# Altium schematic sheet 08_SAMA7G54-DDR3.SchDoc
size 420 x 297 mm; SheetNumber: 16; SheetTotal: 33
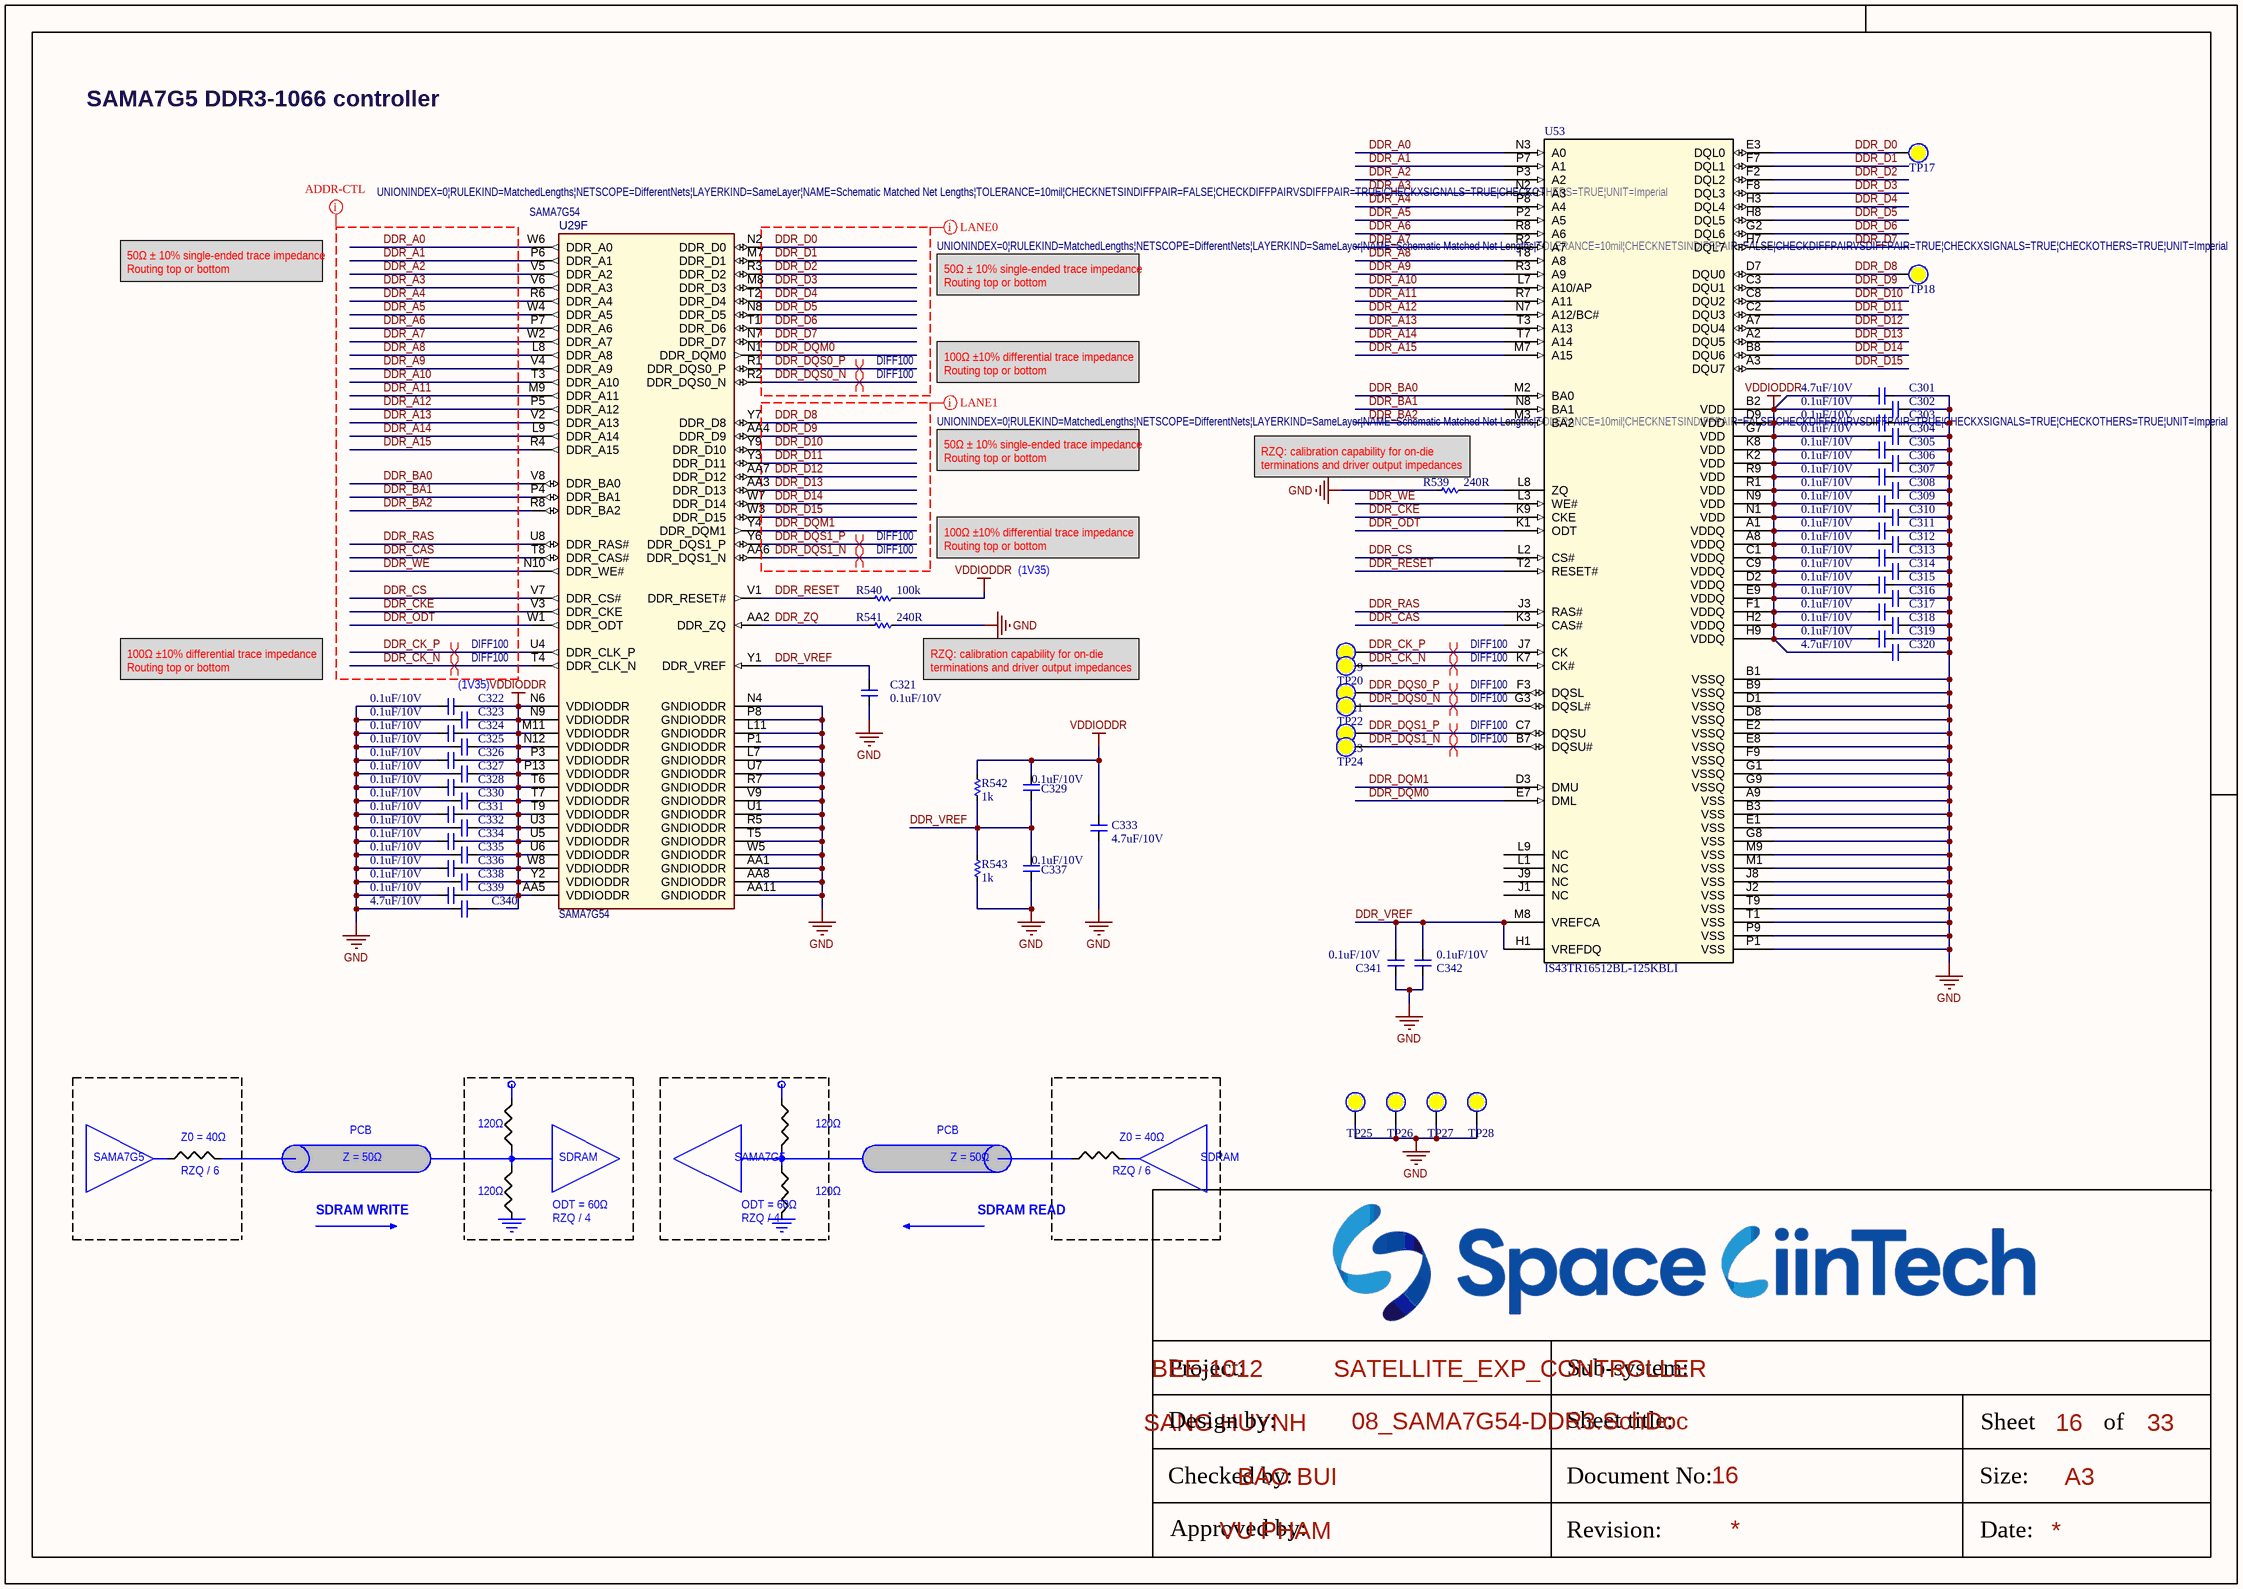
[diagram p0: 08_SAMA7G54-DDR3.SchDoc]

## Parts
C301  4.7uF/10V  [CAP_C_1005X50_L]
C302  0.1uF/10V  [CAP_C_0603x30]
C303  0.1uF/10V  [CAP_C_0603x30]
C304  0.1uF/10V  [CAP_C_0603x30]
C305  0.1uF/10V  [CAP_C_0603x30]
C306  0.1uF/10V  [CAP_C_0603x30]
C307  0.1uF/10V  [CAP_C_0603x30]
C308  0.1uF/10V  [CAP_C_0603x30]
C309  0.1uF/10V  [CAP_C_0603x30]
C310  0.1uF/10V  [CAP_C_0603x30]
C311  0.1uF/10V  [CAP_C_0603x30]
C312  0.1uF/10V  [CAP_C_0603x30]
C313  0.1uF/10V  [CAP_C_0603x30]
C314  0.1uF/10V  [CAP_C_0603x30]
C315  0.1uF/10V  [CAP_C_0603x30]
C316  0.1uF/10V  [CAP_C_0603x30]
C317  0.1uF/10V  [CAP_C_0603x30]
C318  0.1uF/10V  [CAP_C_0603x30]
C319  0.1uF/10V  [CAP_C_0603x30]
C320  4.7uF/10V  [CAP_C_1005X50_L]
C321  0.1uF/10V  [CAP_C_0603x30]
C322  0.1uF/10V  [CAP_C_0603x30]
C323  0.1uF/10V  [CAP_C_0603x30]
C324  0.1uF/10V  [CAP_C_0603x30]
C325  0.1uF/10V  [CAP_C_0603x30]
C326  0.1uF/10V  [CAP_C_0603x30]
C327  0.1uF/10V  [CAP_C_0603x30]
C328  0.1uF/10V  [CAP_C_0603x30]
C329  0.1uF/10V  [CAP_C_0603x30]
C330  0.1uF/10V  [CAP_C_0603x30]
C331  0.1uF/10V  [CAP_C_0603x30]
C332  0.1uF/10V  [CAP_C_0603x30]
C333  4.7uF/10V  [CAP_C_1005X50_L]
C334  0.1uF/10V  [CAP_C_0603x30]
C335  0.1uF/10V  [CAP_C_0603x30]
C336  0.1uF/10V  [CAP_C_0603x30]
C337  0.1uF/10V  [CAP_C_0603x30]
C338  0.1uF/10V  [CAP_C_0603x30]
C339  0.1uF/10V  [CAP_C_0603x30]
C340  4.7uF/10V  [CAP_C_1005X50_L]
C341  0.1uF/10V  [CAP_C_0603x30]
C342  0.1uF/10V  [CAP_C_0603x30]
R539  240R  [RES_C_0603X30]
R540  100k  [RES_C_0603X30]
R541  240R  [RES_C_0603X30]
R542  1k  [RES_C_0603X30]
R543  1k  [RES_C_0603X30]
TP17  (no value)  [TP_1mm_SMD]  (no BOM)
TP18  (no value)  [TP_1mm_SMD]  (no BOM)
TP19  (no value)  [TP_1mm_SMD]  (no BOM)
TP20  (no value)  [TP_1mm_SMD]  (no BOM)
TP21  (no value)  [TP_1mm_SMD]  (no BOM)
TP22  (no value)  [TP_1mm_SMD]  (no BOM)
TP23  (no value)  [TP_1mm_SMD]  (no BOM)
TP24  (no value)  [TP_1mm_SMD]  (no BOM)
TP25  (no value)  [TP_1mm_SMD]  (no BOM)
TP26  (no value)  [TP_1mm_SMD]  (no BOM)
TP27  (no value)  [TP_1mm_SMD]  (no BOM)
TP28  (no value)  [TP_1mm_SMD]  (no BOM)
U29  SAMA7G54  [TFBGA-343_14x14 - 2.5mm]  (part F of 8)
U53  IS43TR16512BL-125KBLI  [TWBGA96_ISI]

## Nets
GND: C301.1 C302.1 C303.1 C304.1 C305.1 C306.1 C307.1 C308.1 C309.1 C310.1 C311.1 C312.1 C313.1 C314.1 C315.1 C316.1 C317.1 C318.1 C319.1 C320.1 C321.2 C322.2 C323.2 C324.2 C325.2 C326.2 C327.2 C328.2 C330.2 C331.2 C332.2 C333.2 C334.2 C335.2 C336.2 C337.2 C338.2 C339.2 C340.2 C341.2 C342.2 R539.2 R541.1 R543.2 TP25.0 TP26.0 TP27.0 TP28.0 U29.AA1(GNDIODDR) U29.AA8(GNDIODDR) U29.AA11(GNDIODDR) U29.L7(GNDIODDR) U29.L11(GNDIODDR) U29.N4(GNDIODDR) U29.P1(GNDIODDR) U29.P8(GNDIODDR) U29.R5(GNDIODDR) U29.R7(GNDIODDR) U29.T5(GNDIODDR) U29.U1(GNDIODDR) U29.U7(GNDIODDR) U29.V9(GNDIODDR) U29.W5(GNDIODDR) U53.A9(VSS) U53.B1(VSSQ) U53.B3(VSS) U53.B9(VSSQ) U53.D1(VSSQ) U53.D8(VSSQ) U53.E1(VSS) U53.E2(VSSQ) U53.E8(VSSQ) U53.F9(VSSQ) U53.G1(VSSQ) U53.G8(VSS) U53.G9(VSSQ) U53.J2(VSS) U53.J8(VSS) U53.M1(VSS) U53.M9(VSS) U53.P1(VSS) U53.P9(VSS) U53.T1(VSS) U53.T9(VSS)
VDDIODDR: C301.2 C302.2 C303.2 C304.2 C305.2 C306.2 C307.2 C308.2 C309.2 C310.2 C311.2 C312.2 C313.2 C314.2 C315.2 C316.2 C317.2 C318.2 C319.2 C320.2 C322.1 C323.1 C324.1 C325.1 C326.1 C327.1 C328.1 C329.1 C330.1 C331.1 C332.1 C333.1 C334.1 C335.1 C336.1 C338.1 C339.1 C340.1 R540.1 R542.1 U29.AA5(VDDIODDR) U29.M11(VDDIODDR) U29.N6(VDDIODDR) U29.N9(VDDIODDR) U29.N12(VDDIODDR) U29.P3(VDDIODDR) U29.P13(VDDIODDR) U29.T6(VDDIODDR) U29.T7(VDDIODDR) U29.T9(VDDIODDR) U29.U3(VDDIODDR) U29.U5(VDDIODDR) U29.U6(VDDIODDR) U29.W8(VDDIODDR) U29.Y2(VDDIODDR) U53.A1(VDDQ) U53.A8(VDDQ) U53.B2(VDD) U53.C1(VDDQ) U53.C9(VDDQ) U53.D2(VDDQ) U53.D9(VDD) U53.E9(VDDQ) U53.F1(VDDQ) U53.G7(VDD) U53.H2(VDDQ) U53.H9(VDDQ) U53.K2(VDD) U53.K8(VDD) U53.N1(VDD) U53.N9(VDD) U53.R1(VDD) U53.R9(VDD)
DDR_A0: U29.W6(DDR_A0) U53.N3(A0)
DDR_A1: U29.P6(DDR_A1) U53.P7(A1)
DDR_A2: U29.V5(DDR_A2) U53.P3(A2)
DDR_A3: U29.V6(DDR_A3) U53.N2(A3)
DDR_A4: U29.R6(DDR_A4) U53.P8(A4)
DDR_A5: U29.W4(DDR_A5) U53.P2(A5)
DDR_A6: U29.P7(DDR_A6) U53.R8(A6)
DDR_A7: U29.W2(DDR_A7) U53.R2(A7)
DDR_A8: U29.L8(DDR_A8) U53.T8(A8)
DDR_A9: U29.V4(DDR_A9) U53.R3(A9)
DDR_A10: U29.T3(DDR_A10) U53.L7(A10/AP)
DDR_A11: U29.M9(DDR_A11) U53.R7(A11)
DDR_A12: U29.P5(DDR_A12) U53.N7(A12/BC#)
DDR_A13: U29.V2(DDR_A13) U53.T3(A13)
DDR_A14: U29.L9(DDR_A14) U53.T7(A14)
DDR_A15: U29.R4(DDR_A15) U53.M7(A15)
DDR_BA0: U29.V8(DDR_BA0) U53.M2(BA0)
DDR_BA1: U29.P4(DDR_BA1) U53.N8(BA1)
DDR_BA2: U29.R8(DDR_BA2) U53.M3(BA2)
DDR_CAS: U29.T8(DDR_CAS#) U53.K3(CAS#)
DDR_CK_N: TP20.0 U29.T4(DDR_CLK_N) U53.K7(CK#)
DDR_CK_P: TP19.0 U29.U4(DDR_CLK_P) U53.J7(CK)
DDR_CKE: U29.V3(DDR_CKE) U53.K9(CKE)
DDR_CS: U29.V7(DDR_CS#) U53.L2(CS#)
DDR_D0: TP17.0 U29.N2(DDR_D0) U53.E3(DQL0)
DDR_D1: U29.M7(DDR_D1) U53.F7(DQL1)
DDR_D2: U29.R3(DDR_D2) U53.F2(DQL2)
DDR_D3: U29.M8(DDR_D3) U53.F8(DQL3)
DDR_D4: U29.T2(DDR_D4) U53.H3(DQL4)
DDR_D5: U29.N8(DDR_D5) U53.H8(DQL5)
DDR_D6: U29.T1(DDR_D6) U53.G2(DQL6)
DDR_D7: U29.N7(DDR_D7) U53.H7(DQL7)
DDR_D8: TP18.0 U29.Y7(DDR_D8) U53.D7(DQU0)
DDR_D9: U29.AA4(DDR_D9) U53.C3(DQU1)
DDR_D10: U29.Y9(DDR_D10) U53.C8(DQU2)
DDR_D11: U29.Y3(DDR_D11) U53.C2(DQU3)
DDR_D12: U29.AA7(DDR_D12) U53.A7(DQU4)
DDR_D13: U29.AA3(DDR_D13) U53.A2(DQU5)
DDR_D14: U29.W7(DDR_D14) U53.B8(DQU6)
DDR_D15: U29.W3(DDR_D15) U53.A3(DQU7)
DDR_DQM0: U29.N1(DDR_DQM0) U53.E7(DML)
DDR_DQM1: U29.Y4(DDR_DQM1) U53.D3(DMU)
DDR_DQS0_N: TP22.0 U29.R2(DDR_DQS0_N) U53.G3(DQSL#)
DDR_DQS0_P: TP21.0 U29.R1(DDR_DQS0_P) U53.F3(DQSL)
DDR_DQS1_N: TP24.0 U29.AA6(DDR_DQS1_N) U53.B7(DQSU#)
DDR_DQS1_P: TP23.0 U29.Y6(DDR_DQS1_P) U53.C7(DQSU)
DDR_ODT: U29.W1(DDR_ODT) U53.K1(ODT)
DDR_RAS: U29.U8(DDR_RAS#) U53.J3(RAS#)
DDR_RESET: R540.2 U29.V1(DDR_RESET#) U53.T2(RESET#)
DDR_VREF: C321.1 C329.2 C337.1 C341.1 C342.1 R542.2 R543.1 U29.Y1(DDR_VREF) U53.H1(VREFDQ) U53.M8(VREFCA)
DDR_WE: U29.N10(DDR_WE#) U53.L3(WE#)
DDR_ZQ: R541.2 U29.AA2(DDR_ZQ)
NetR539_1: R539.1 U53.L8(ZQ)

Not connected (* = marked no-connect by the designer): U53 J1(NC) J9(NC) L1(NC) L9(NC)

## Layout directives
net class DDR-LANE0; rule Matched Net Lengths [Tolerance = 10mil]: DDR_D0, DDR_D1, DDR_D2, DDR_D3, DDR_D4, DDR_D5, DDR_D6, DDR_D7, DDR_DQM0, DDR_DQS0_N, DDR_DQS0_P
net class DDR-LANE1; rule Matched Net Lengths [Tolerance = 10mil]: DDR_D8, DDR_D9, DDR_D10, DDR_D11, DDR_D12, DDR_D13, DDR_D14, DDR_D15, DDR_DQM1, DDR_DQS1_N, DDR_DQS1_P
net class DDR-ADDR-CTL; rule Matched Net Lengths [Tolerance = 10mil]: DDR_A0, DDR_A1, DDR_A2, DDR_A3, DDR_A4, DDR_A5, DDR_A6, DDR_A7, DDR_A8, DDR_A9, DDR_A10, DDR_A11, DDR_A12, DDR_A13, DDR_A14, DDR_A15, DDR_BA0, DDR_BA1, DDR_BA2, DDR_CAS, DDR_CK_N, DDR_CK_P, DDR_CKE, DDR_CS, DDR_ODT, DDR_RAS, DDR_WE
differential pair; differential pair class DIFF100; net class DIFF100; rule Matched Net Lengths [Tolerance = 4mil]: DDR_CK_N, DDR_CK_P, DDR_DQS0_N, DDR_DQS0_P, DDR_DQS1_N, DDR_DQS1_P

## Notes on the sheet
- SAMA7G5 DDR3-1066 controller
- 50Ω ± 10% single-ended trace impedance
  Routing top or bottom
- 100Ω ±10% differential trace impedance
  Routing top or bottom
- (near R539) RZQ: calibration capability for on-die terminations and driver output impedances
- (1V35)
- (near C322) (1V35)
- RZQ: calibration capability for on-die terminations and driver output impedances
- PCB
- 120Ω
- SAMA7G5
- Z0 = 40Ω
- RZQ / 6
- Z = 50Ω
- ODT = 60Ω
- SDRAM
- SDRAM WRITE
- RZQ / 4
- SDRAM READ
- Project:
- BEE-1012
- Sub-system:
- SATELLITE_EXP_CONTROLLER
- Design by:
- SANG HUYNH
- BAO BUI
- Sheet title:
- Sheet
- A3
- of
- Checked by:
- Approved by:
- VU PHAM
- Revision:
- Document No:
- Size:
- Date:

## Library data of the parts
C301-C342 = _CAP_C_2: CAP
R539-R543 = _RES_B_2: RES
TP17-TP28 = Test Point: Solder: NF
U29 = SAMA7G54: SAMA7G54 MPU 1000MHz Cortex-A7 TFBGA-343; Manufacturer Part Number 1: SAMA7G54-V/4HB; Manufacturer 1: Microchip; Description_: MCHP MPU 32-BIT Cortex-A7 1000MHz 128kB SAMA7G54-V/4HB TFBGA-343; Populated: YES; MCHP-ID: MIC8923; Symbol: SAMA7G54 TFBGA-343; Dev Tools Status: Design; Owner: Ciprian Abramov; Package: TFBGA-343; Value: SAMA7G54; Type: 32-Bit MPU; Status: MCL Design; Revision: 1; Category: MCHP-Microcontroller; ComponentLink1Description: SVN Datasheet; ComponentLink2Description: Local Datasheet; ComponentLink3URL: C:\ALTIUM_WORK\00001_MCHP-CDB\Library\LibraryRefs\SAMA7G54 TFBGA-343.SchLib; ComponentLink3Description: Open Symbol; ComponentLink4URL: C:\ALTIUM_WORK\00001_MCHP-CDB\Library\Footprints\TFBGA-343_14x14.PcbLib; ComponentLink4Description: Open Footprint; ComponentLink5Description: Open Footprint 2; ComponentLink6Description: Open Footprint 3; ComponentLink7Description: Open Footprint 4; Supplier 1: Microchip; Supplier Part Number 1: SAMA7G54-V/4HB; Quantity Override: 1
U53 = IC_RAM_IS43TR16512BL-125KBLI: DDR3L; Manufacturer_Name: ISSI; Copyright: Copyright (C) 2025 Ultra Librarian. All rights reserved.; Manufacturer_Part_Number: IS43TR16512BL-125KBLI; RefDes: RefDes; Type: Type